# Altium project Rubiks_Controller.PrjPcb
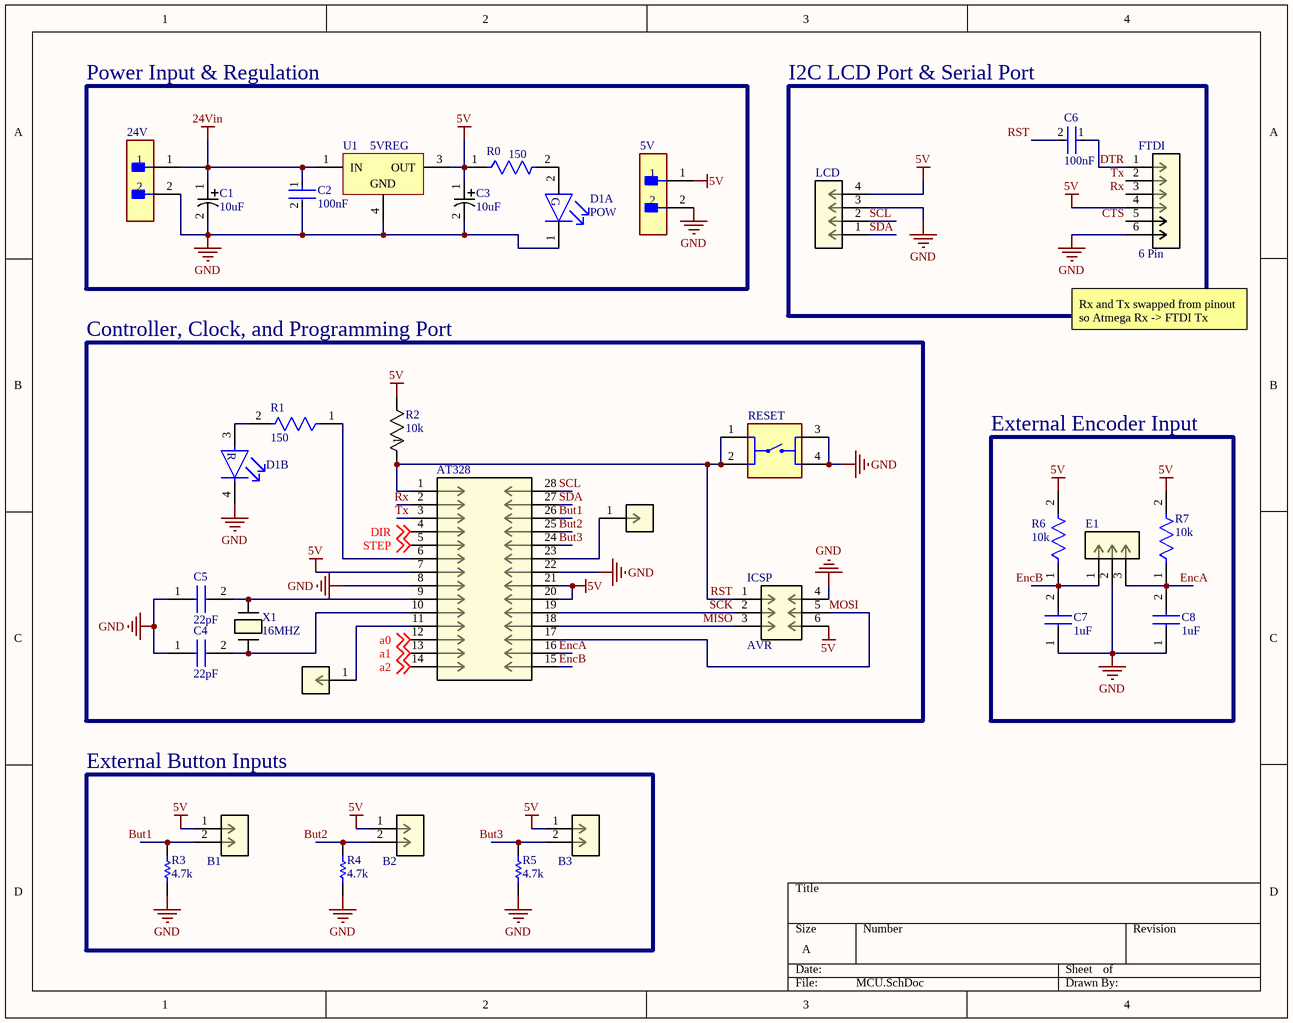
[diagram p0: MCU.SchDoc]
3 sheets, 62 parts. Net scope: global (net labels, ports and power ports of the same name join across sheets).
Board file: MainControl.PcbDoc
Sheets:
  MCU.SchDoc
  ComboLogic.SchDoc
  MotorDrive.SchDoc

## Sheet MCU.SchDoc
size A; SheetNumber: 1; SheetTotal: 3

### Parts
5V  (no value)  [FP-TSW-102-07-L-S-MFG]
24V  (no value)  [FP-TSW-102-07-L-S-MFG]
AT328  Atmega328  [CONN28_1-2199298-9_TEC]  (value not drawn)
B1  Header  [1x2StanHeader]  (value not drawn)
B2  Header  [1x2StanHeader]  (value not drawn)
B3  Header  [1x2StanHeader]  (value not drawn)
C1  10uF  [CAP_EEE_C_PAN-M]
C2  100nF  [FP-CL21-IPC_C]
C3  10uF  [CAP_EEE_C_PAN-M]
C4  22pF  [C0805]
C5  22pF  [C0805]
C6  100nF  [FP-CL21-IPC_C]
C7  1uF  [CAPC2012X135N]
C8  1uF  [CAPC2012X135N]
D1  POW  [FP-LTST-C235KGKRKT-MFG]  (parts A,B of 2)
E1  Encoder  [1x3StanHeader]  (value not drawn)
FTDI  6 Pin  [USB FTDI 1x6]
ICSP  AVR  [2x3StanHeader]
JB  Header  [1x1StanHeader]  (value not drawn)
JC  Header  [1x1StanHeader]  (value not drawn)
LCD  LCD  [1x4StanHeader]  (value not drawn)
R0  150  [FP-ERJ6GE-MFG]
R1  150  [FP-ERJ6GE-MFG]
R2  10k  [RES_AC0805_YAG-M]
R3  4.7k  [RESC2013X50X30LL20T20]
R4  4.7k  [RESC2013X50X30LL20T20]
R5  4.7k  [RESC2013X50X30LL20T20]
R6  10k  [FP-MC01W0805-IPC_C]
R7  10k  [FP-MC01W0805-IPC_C]
RESET  Reset  [SW_1825910-6-4]  (value not drawn)
U1  5VREG  [TO-263_M]
X1  16MHZ  [XTAL_ATS-49_CTS]

### Blocks framed on the sheet
Power Input & Regulation: 5V 24V C1-C3 D1 R0 U1
I2C LCD Port & Serial Port: C6 FTDI LCD
Controller, Clock, and Programming Port: AT328 C4 C5 D1 ICSP JB JC R1 R2 RESET X1
External Encoder Input: C7 C8 E1 R6 R7
External Button Inputs: B1-B3 R3-R5

### Nets
5V: 5V.1 AT328.7 AT328.20 AT328.21 B1.1 B2.1 B3.1 C3.1 FTDI.4 ICSP.6 LCD.4 R0.1 R2.2 R6.2 R7.2 U1.3(OUT)
24Vin: 24V.1 C1.1 C2.1 U1.1(IN)
GND: 5V.2 24V.2 AT328.8 AT328.22 C1.2 C2.2 C3.2 C4.1 C5.1 C7.1 C8.1 D1.1(Green_C) D1.4(Red_C) E1.2 FTDI.6 ICSP.4 LCD.3 R3.1 R4.1 R5.1 RESET.3 RESET.4 U1.4(GND)
a0: AT328.12 ; off-sheet a0
a1: AT328.13 ; off-sheet a1
a2: AT328.14 ; off-sheet a2
But1: AT328.26 B1.2 R3.2
But2: AT328.25 B2.2 R4.2
But3: AT328.24 B3.2 R5.2
CTS: FTDI.5
DIR: AT328.4 ; off-sheet DIR
DTR: C6.1 FTDI.1
EncA: AT328.16 C8.2 E1.3 R7.1
EncB: AT328.15 C7.2 E1.1 R6.1
MISO: AT328.18 ICSP.3
MOSI: AT328.17 ICSP.5
RST: AT328.1 C6.2 ICSP.1 R2.1 RESET.1 RESET.2
Rx: AT328.2 FTDI.3
SCK: AT328.19 ICSP.2
SCL: AT328.28 LCD.2
SDA: AT328.27 LCD.1
STEP: AT328.5 ; off-sheet STEP
Tx: AT328.3 FTDI.2
NetAT328_6: AT328.6 R1.1
NetAT328_9: AT328.9 C5.2 X1.2
NetAT328_10: AT328.10 C4.2 X1.1
NetAT328_11: AT328.11 JB.1
NetAT328_23: AT328.23 JC.1
NetD1_2: D1.2(Green_A) R0.2
NetD1_3: D1.3(Red_A) R1.2

### Notes on the sheet
- Rx and Tx swapped from pinout so Atmega Rx -> FTDI Tx
- (in symbol CMP-22017-000042-1, part A) G
- (in symbol CMP-22017-000042-1, part B) R

### Library data of the parts
5V 24V = CMP-02766-001428-1: CONN HEADER VERT 2POS 2.54MM   TSW-102-07-L-S; Voltage Rating: 550V; Current Rating: 7.6A; Gender: Male; Number of Contacts: 2; Connector Type: Male Pin; Radiation Hardening: No; Orientation: Straight; Contact Plating: Gold; Max Operating Temperature: 125°C; Mount: Through Hole; Package Quantity: 1; Number of Rows: 1; Housing Material: Polyester; RoHS Compliant: Yes; Length: 5.08mm; Max Voltage Rating (AC): 550V; Pitch: 2.54mm; Packaging: Bulk; Depth: 2.54mm; Termination: Solder; Min Operating Temperature: -55°C; Housing Color: Black; Lead Free: Lead Free; Color: Black; Number of Positions: 2; Width: 2.54mm; Max Current Rating: 7.6A; REACH SVHC: No SVHC; Contact Material: Bronze; Contact Mating Length: 0.23inch; Series: TSW; Contact Type: Male Pin
AT328 = 14x2_J: No Description Available   1-2199298-9; Mfr_Name: TE Connectivity; Type: DEV; Copyright: Copyright (C) 2022 Ultra Librarian. All rights reserved.; Manufacturer_Part_Number: 1-2199298-9; RefDes: RefDes
B1-B3 = 2x1_J: No Description Available; Manufacturer_Part_Number: 5-826631-0; Vendor: TE Connectivity; Built_By: EMA_UL_Team; SourceLibrary: Tyco_2012-04-26; Copyright: Copyright (C) 2018 Accelerated Designs. All rights reserved; RefDes: RefDes; Type: DEV
C1 C3 = EEE-1VA100SR: Mfr_Name: Panasonic; Type: DEV; Copyright: Copyright (C) 2022 Ultra Librarian. All rights reserved.; Manufacturer_Part_Number: EEE-1VA100SR; RefDes: RefDes
C2 C6 = CMP-2000-05017-2: CL21 Series 0805 100nF 50V ±10% Tolerance X7R Multilayer Ceramic Chip Capacitor CL21B104KBCNNNC; Depth: 1.25mm; Height: 0.85mm; Width: 0.049inch; Tolerance: 10%; Case Code (Metric): 2012; Case Code (Imperial): 0805; Material: Ceramic; Thickness: 0.037inch; Min Operating Temperature: -55°C; Contact Plating: Tin; Length: 2mm; Mount: Surface Mount; Voltage Rating (DC): 50V; Lead Free: Lead Free; Dielectric: X7R; Radiation Hardening: No; Capacitance: 100nF; Voltage Rating: 50V; Case/Package: 0805; Packaging: Tape and Reel; Max Operating Temperature: 125°C; Voltage: 50V
C4 C5 = C0805C220J4GACTU: Capacitor C0805C220J4GACTU; Manufacturer_Name: KEMET; Datasheet Link: https://componentsearchengine.com//C0805C220J4GACTU.pdf; Height: 1.1mm; Mouser2 Part Number: 80-C0805C220J4GACTU; Mouser2 Price/Stock: https://www.mouser.com/Search/Refine.aspx?Keyword=80-C0805C220J4GACTU; Manufacturer_Part_Number: C0805C220J4GACTU
C7 C8 = CL21B105KAFNNNE: Capacitor CL21B105KAFNNNE; Manufacturer_Name: Samsung Electro-Mechanics; Datasheet Link: https://media.digikey.com/pdf/Data%20Sheets/Samsung%20PDFs/CL_Series_MLCC_ds.pdf; Height: 1.35mm; Manufacturer_Part_Number: CL21B105KAFNNNE; Mouser Part Number: 187-CL21B105KAFNNNE; Mouser Price/Stock: https://www.mouser.co.uk/ProductDetail/Samsung-Electro-Mechanics/CL21B105KAFNNNE?qs=349EhDEZ59rlwSnoUrPIow%3D%3D; Arrow Part Number: CL21B105KAFNNNE; Arrow Price/Stock: https://www.arrow.com/en/products/cl21b105kafnnne/samsung-electro-mechanics
D1 = CMP-22017-000042-1: LED GREEN/RED CLEAR CHIP SMD LTST-C235KGKRKT; Luminous Intensity: 45mcd; Power Rating: 75mW; Forward Voltage: 2V; Illumination Color: Green; Number of LEDs: 2; Lens Color: Colorless; Test Current: 20mA; Dominant Wavelength: 631nm; Viewing Angle: 130°; Reverse Voltage: 5V; Mount: Surface Mount; Case/Package: SMD/SMT; Case Code (Metric): 3216; Case Code (Imperial): 1206; Height: 1.1mm; Color: Green; Package Quantity: 1; Radiation Hardening: No; Width: 1.6mm; Lens Transparency: Clear; Depth: 1.6mm; Lens Style: Clear; Forward Current: 20mA; Number of Pins: 4; Power Dissipation: 75mW; Min Operating Temperature: -30°C; Length: 3.2mm; Lead Free: Lead Free; Packaging: Tape and Reel; Max Operating Temperature: 85°C; Number of Elements: 2; RoHS Compliant: Yes
E1 = 3x1_J: No Description Available; Manufacturer_Part_Number: 5-826631-0; Vendor: TE Connectivity; Built_By: EMA_UL_Team; SourceLibrary: Tyco_2012-04-26; Copyright: Copyright (C) 2018 Accelerated Designs. All rights reserved; RefDes: RefDes; Type: DEV
FTDI = FTDI USB: No Description Available; Manufacturer_Part_Number: 5-826631-0; Vendor: TE Connectivity; Built_By: EMA_UL_Team; SourceLibrary: Tyco_2012-04-26; Copyright: Copyright (C) 2018 Accelerated Designs. All rights reserved; RefDes: RefDes; Type: DEV
ICSP = 2x3_J: No Description Available; Manufacturer_Part_Number: 5-826631-0; Vendor: TE Connectivity; Built_By: EMA_UL_Team; SourceLibrary: Tyco_2012-04-26; Copyright: Copyright (C) 2018 Accelerated Designs. All rights reserved; RefDes: RefDes; Type: DEV
JB JC = 1x1_J: No Description Available; Manufacturer_Part_Number: 5-826631-0; Vendor: TE Connectivity; Built_By: EMA_UL_Team; SourceLibrary: Tyco_2012-04-26; Copyright: Copyright (C) 2018 Accelerated Designs. All rights reserved; RefDes: RefDes; Type: DEV
LCD = 4x1_J: No Description Available; Manufacturer_Part_Number: 5-826631-0; Vendor: TE Connectivity; Built_By: EMA_UL_Team; SourceLibrary: Tyco_2012-04-26; Copyright: Copyright (C) 2018 Accelerated Designs. All rights reserved; RefDes: RefDes; Type: DEV
R0 R1 = CMP-1013-00054-3: RES SMD 150 OHM 5% 1/8W 0805 ERJ-6GEYJ151V; Manufacturer: Panasonic; Temperature Coefficient: 200ppm/°C; Voltage Rating: 150V; Value: 150Ω; Power Rating: 0.125W; Automotive Grade: Grade 0; RoHS: TRUE; Series: ERJ; Tolerance: 5%; Height: 0.7mm; Device Class L1: Passive Components; Temperature Range Low: -55°C; Device Class L3: Chip SMD Resistors; Lead Free: Yes; Manufacturer Part Number: ERJ-6GEYJ151V; Composition: Thick Film; Temperature: -55°C to +155°C; Mouser Description: Thick Film Resistors - SMD 0805 150ohms 5% Tol; Footprint Url: https://industrial.panasonic.com/cdbs/www-data/pdf/RDA0000/DMA0000COL17.pdf; Device Class L2: Resistors; Category: Res; Ipc Land Pattern Name: RESC200125X60; Temperature Range High: +155°C; ComponentLink2URL: https://industrial.panasonic.com/ww/products/resistors/chip-resistors/general-purpose-chip-resistors/thick-film-chip-resistors/ERJ6GEYJ151V; Package: ERJ6GE; Digikey Description: RES SMD 150 OHM 5% 1/8W 0805; Resistance: 150Ω; ComponentLink2Description: Datasheet; Octopart: https://octopart.com/erj-6geyj151v-panasonic-55422917; Automotive: Yes
R2 = AC0805FR-070RL: Mfr_Name: Yageo; Copyright: Copyright (C) 2022 Ultra Librarian. All rights reserved.; Manufacturer_Part_Number: AC0805FR-070RL; RefDes: RefDes; Type: DEV
R3-R5 = CMP-2001-03968-1: CRCW08054K70JNEB; Manufacturer: Vishay Dale; Part Number: CRCW08054K70JNEB
R6 R7 = CMP-12256-000003-1: Resistor, 10K, 0.1W, 1%, 0805, Reel MC01W0805110K; Resistance: 10kR; Voltage Rating: 150V; Temperature Coefficient: 100ppm/°C; Power Rating: 100mW; REACH SVHC: No SVHC; Composition: Thick Film; Max Operating Temperature: 155°C; Case/Package: 0805; Tolerance: 1%; Number of Pins: 2; Case Code (Metric): 2012; Voltage Rating (DC): 150V; Min Operating Temperature: -55°C; Width: 1.25mm; Case Code (Imperial): 0805; Packaging: Cut Tape
RESET = CMP-009-000000-1: Switch Tactile OFF (ON) SPST Round Button PC Pins 0.05A 24VDC 100000Cycles 1.57N Thru-Hole Loose; Value: *; Package: None; Pin Count: 4; Price: None; Component Type: Standard; Design Item ID: 1825910-6; Source: 1825910-6.SchLib; Availability: Unavailable; MP: 1825910-6
U1 = CMP-0244-00213-1: Positive Voltage Regulator, 3-Pin D2PAK, Tape and Reel L7805CD2T-TR; PackageReference: TO-263; ComponentLink2URL: http://www.st.com/internet/com/TECHNICAL_RESOURCES/TECHNICAL_LITERATURE/DATASHEET/CD00000444.pdf; PackageDescription: 3-Pin Transistor Outline Package 2.54 mm Pitch, 15.4 mm Lead Span (D2PAK); DatasheetVersion: 16/11/2011; ComponentLink2Description: Datasheet; ComponentLink1Description: Manufacturer URL; PackageVersion: 2011; ComponentLink1URL: http://www.st.com
X1 = ATS-49/U-16.0000MHZ: Mfr_Name: CTS Components; Copyright: Copyright (C) 2022 Ultra Librarian. All rights reserved.; Manufacturer_Part_Number: ATS-49/U-16.0000MHZ; RefDes: RefDes; Type: DEV

## Sheet ComboLogic.SchDoc
size A; SheetNumber: 2; SheetTotal: 3
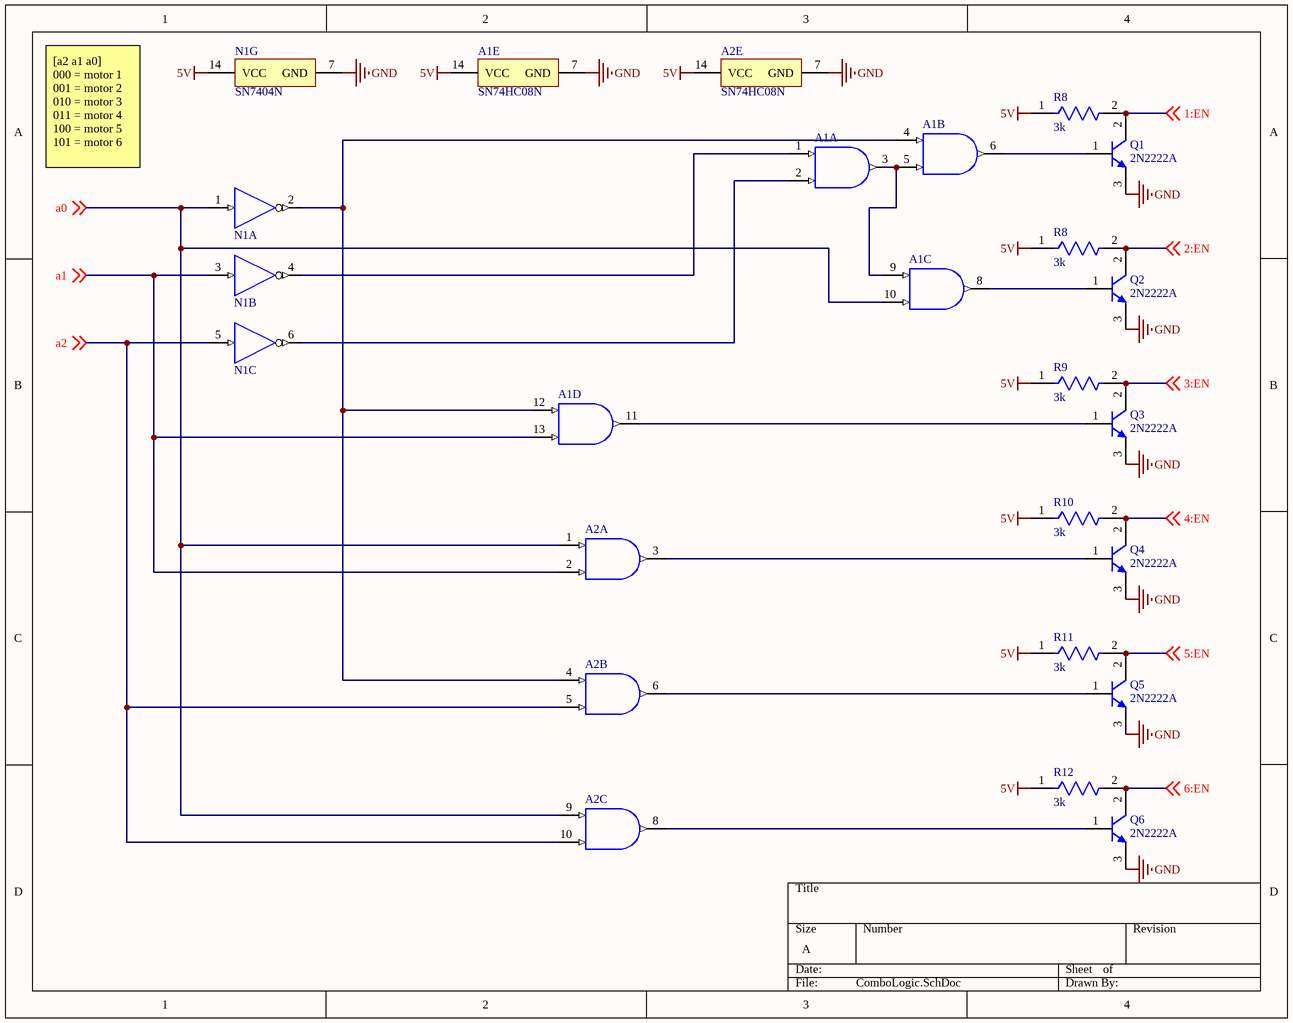
[diagram p1: ComboLogic.SchDoc]

### Parts
(Parts that share a designator on the sheet are numbered #1, #2 ... from top to bottom, then left to right.)
A1#1  SN74HC08N  [N0014A]  (value not drawn)  (parts A,B,C,D,E of 5)
A2#1  SN74HC08N  [N0014A]  (value not drawn)  (parts A,B,C,E of 5)
N1  SN7404N  [N0014A]  (value not drawn)  (parts A,B,C,G of 7)
Q1  2N2222A  [STM-TO-18-3]
Q2  2N2222A  [STM-TO-18-3]
Q3  2N2222A  [STM-TO-18-3]
Q4  2N2222A  [STM-TO-18-3]
Q5  2N2222A  [STM-TO-18-3]
Q6  2N2222A  [STM-TO-18-3]
R8#1  3k  [FP-RR1220-IPC_B]
R8#2  3k  [FP-RR1220-IPC_B]
R9  3k  [FP-RR1220-IPC_B]
R10  3k  [FP-RR1220-IPC_B]
R11  3k  [FP-RR1220-IPC_B]
R12  3k  [FP-RR1220-IPC_B]

### Nets
5V: A1#1.14(VCC) A2#1.14(VCC) N1.14(VCC) R8#1.1 R8#2.1 R9.1 R10.1 R11.1 R12.1
GND: A1#1.7(GND) A2#1.7(GND) N1.7(GND) Q1.3(E) Q2.3(E) Q3.3(E) Q4.3(E) Q5.3(E) Q6.3(E)
1:EN: Q1.2(C) R8#1.2 ; off-sheet 1:EN
2:EN: Q2.2(C) R8#2.2 ; off-sheet 2:EN
3:EN: Q3.2(C) R9.2 ; off-sheet 3:EN
4:EN: Q4.2(C) R10.2 ; off-sheet 4:EN
5:EN: Q5.2(C) R11.2 ; off-sheet 5:EN
6:EN: Q6.2(C) R12.2 ; off-sheet 6:EN
a0: A1#1.10(3B) A2#1.1(1A) A2#1.9(3A) N1.1(1A) ; off-sheet a0
a1: A1#1.13(4B) A2#1.2(1B) N1.3(2A) ; off-sheet a1
a2: A2#1.5(2B) A2#1.10(3B) N1.5(3A) ; off-sheet a2
NetA1#1_1: A1#1.1(1A) N1.4(~{2Y})
NetA1#1_2: A1#1.2(1B) N1.6(~{3Y})
NetA1#1_3: A1#1.3(1Y) A1#1.5(2B) A1#1.9(3A)
NetA1#1_4: A1#1.4(2A) A1#1.12(4A) A2#1.4(2A) N1.2(~{1Y})
NetA1#1_6: A1#1.6(2Y) Q1.1(B)
NetA1#1_8: A1#1.8(3Y) Q2.1(B)
NetA1#1_11: A1#1.11(4Y) Q3.1(B)
NetA2#1_3: A2#1.3(1Y) Q4.1(B)
NetA2#1_6: A2#1.6(2Y) Q5.1(B)
NetA2#1_8: A2#1.8(3Y) Q6.1(B)

### Notes on the sheet
- [a2 a1 a0]
  000 = motor 1
  001 = motor 2
  010 = motor 3
  011 = motor 4
  100 = motor 5
  101 = motor 6

### Library data of the parts
A1#1 A2#1 = CMP-0777-00250-3: Quadruple 2-Input Positive-AND Gates, N0014A, TUBE; Manufacturer: Texas Instruments; Output Type: CMOS; ICC @ Nom Voltage(Max)(mA): 0.02; tpd @ Nom Voltage(Max)(ns): 28; Voltage(Nom)(V): 5; VCC(Min)(V): 2; Technology Family: HC; F @ Nom Voltage(Max)(Mhz): 70; Rating: Catalog; Bits(#): 4; Schmitt Trigger: No; VCC(Max)(V): 6; PackageReference: N0014A; Input Type: CMOS; Generic Part Number: SN74HC08; DatasheetVersion: SCLS081F; Operating Temperature Range(C): -40 to 85
N1 = CMP-1615-00872-2: Hex inverters, N0014A, TUBE; Generic Part Number: SN7404; Manufacturer: Texas Instruments; Voltage(Nom)(V): 5; Bits(#): 6; tpd @ Nom Voltage(Max)(ns): 22; Schmitt Trigger: No; VCC(Max)(V): 5.25; ICC @ Nom Voltage(Max)(mA): 0.033; Technology Family: TTL; Rating: Catalog; F @ Nom Voltage(Max)(Mhz): 35; Output Type: CMOS; VCC(Min)(V): 4.75; Output Drive (IOL/IOH)(Max)(mA): -0.4/16; DatasheetVersion: SDLS029C; Code_JEDEC: MS-001; Operating Temperature Range(C): 0 to 70; PackageReference: N0014A; Input Type: TTL
Q1-Q6 = CMP-2000-05381-1: High Speed Switch, 0.6 A IC, -65 to 175 degC, 3-Pin TO-18, RoHS, Bulk; Manufacturer: STMicroelectronics; Power Dissipation Pd: 500mW; DC Current Gain hFE: 300hFE; Transistor Polarity: NPN; DC Collector Current: 600mA; No. of Pins: 3Pins; Transition Frequency ft: 300MHz; Collector Emitter Voltage V(br)ceo: 40V; Product Range: -; Package Reference: TO-18-3; Datasheet URL: https://datasheet.ciiva.com/25917/cd00003223-25917094.pdf; Automotive Qualification Standard: -; Transistor Case Style: TO-18; Operating Temperature Max: 175degC; Datasheet Version: Feb-03; Package Description: 3-Pin Through Hole Device, Dia 5.8 mm, Pitch 1.27 mm; Manufacturer URL: http://www.st.com/
R8#1 R8#2 R9-R12 = CMP-2001-03369-2: 3kΩ ±0.5% 0.1W 1/10W Chip Resistor 0805 (2012 Metric) Thin Film; Temperature Coefficient: 25ppm/°C; Voltage Rating: 100V; Max Power Dissipation: 100mW; Resistance: 3kR; Min Operating Temperature: -55°C; Resistor Type: Thin Film; Mount: Surface Mount; Case Code (Imperial): 0805; Technology: THIN FILM; Length: 2mm; Voltage Rating (DC): 100V; Case/Package: 0805; Depth: 1.25mm; Lead Free: Lead Free; Packaging: Tape and Reel; Series: RR; Termination: SMD/SMT; Tolerance: 0.5%; Package Quantity: 1; Max Operating Temperature: 125°C; RoHS Compliant: Yes; Width: 0.049inch; Height: 0.4mm; Number of Terminations: 2; Case Code (Metric): 2012; Size Code: 0805; Number of Pins: 2; Power Rating: 100mW

## Sheet MotorDrive.SchDoc
size A; SheetNumber: 3; SheetTotal: 3
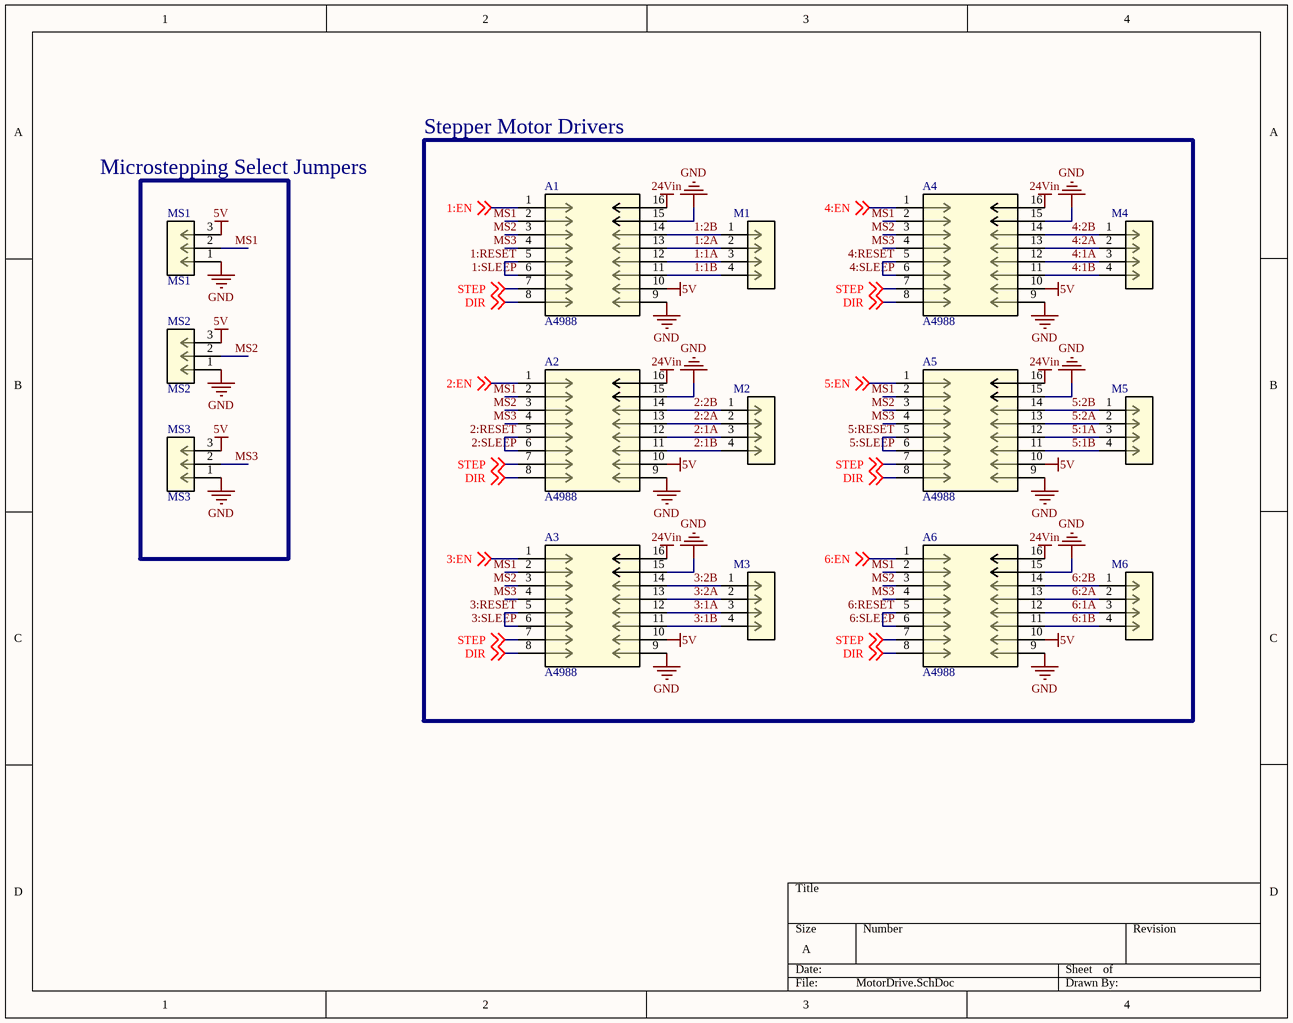
[diagram p2: MotorDrive.SchDoc]

### Parts
(Parts that share a designator on the sheet are numbered #1, #2 ... from top to bottom, then left to right.)
A1#2  A4988  [2x8A4988]
A2#2  A4988  [2x8A4988]
A3  A4988  [2x8A4988]
A4  A4988  [2x8A4988]
A5  A4988  [2x8A4988]
A6  A4988  [2x8A4988]
M1  (no value)  [1x4StanHeader]
M2  (no value)  [1x4StanHeader]
M3  (no value)  [1x4StanHeader]
M4  (no value)  [1x4StanHeader]
M5  (no value)  [1x4StanHeader]
M6  (no value)  [1x4StanHeader]
MS1  MS1  [1x3StanHeader]
MS2  MS2  [1x3StanHeader]
MS3  MS3  [1x3StanHeader]

### Blocks framed on the sheet
Stepper Motor Drivers: A1#2 A2#2 A3-A6 M1-M6

### Nets
5V: A1#2.10 A2#2.10 A3.10 A4.10 A5.10 A6.10 MS1.3 MS2.3 MS3.3
24Vin: A1#2.16 A2#2.16 A3.16 A4.16 A5.16 A6.16
GND: A1#2.9 A1#2.15 A2#2.9 A2#2.15 A3.9 A3.15 A4.9 A4.15 A5.9 A5.15 A6.9 A6.15 MS1.1 MS2.1 MS3.1
1:1A: A1#2.12 M1.3
1:1B: A1#2.11 M1.4
1:2A: A1#2.13 M1.2
1:2B: A1#2.14 M1.1
1:EN: A1#2.1 ; off-sheet 1:EN
1:RESET: A1#2.5 A1#2.6  [also labelled 1:SLEEP]
2:1A: A2#2.12 M2.3
2:1B: A2#2.11 M2.4
2:2A: A2#2.13 M2.2
2:2B: A2#2.14 M2.1
2:EN: A2#2.1 ; off-sheet 2:EN
2:RESET: A2#2.5 A2#2.6  [also labelled 2:SLEEP]
3:1A: A3.12 M3.3
3:1B: A3.11 M3.4
3:2A: A3.13 M3.2
3:2B: A3.14 M3.1
3:EN: A3.1 ; off-sheet 3:EN
3:RESET: A3.5 A3.6  [also labelled 3:SLEEP]
4:1A: A4.12 M4.3
4:1B: A4.11 M4.4
4:2A: A4.13 M4.2
4:2B: A4.14 M4.1
4:EN: A4.1 ; off-sheet 4:EN
4:RESET: A4.5 A4.6  [also labelled 4:SLEEP]
5:1A: A5.12 M5.3
5:1B: A5.11 M5.4
5:2A: A5.13 M5.2
5:2B: A5.14 M5.1
5:EN: A5.1 ; off-sheet 5:EN
5:RESET: A5.5 A5.6  [also labelled 5:SLEEP]
6:1A: A6.12 M6.3
6:1B: A6.11 M6.4
6:2A: A6.13 M6.2
6:2B: A6.14 M6.1
6:EN: A6.1 ; off-sheet 6:EN
6:RESET: A6.5 A6.6  [also labelled 6:SLEEP]
DIR: A1#2.8 A2#2.8 A3.8 A4.8 A5.8 A6.8 ; off-sheet DIR
MS1: A1#2.2 A2#2.2 A3.2 A4.2 A5.2 A6.2 MS1.2
MS2: A1#2.3 A2#2.3 A3.3 A4.3 A5.3 A6.3 MS2.2
MS3: A1#2.4 A2#2.4 A3.4 A4.4 A5.4 A6.4 MS3.2
STEP: A1#2.7 A2#2.7 A3.7 A4.7 A5.7 A6.7 ; off-sheet STEP

### Notes on the sheet
- Microstepping Select Jumpers

### Library data of the parts
A1#2 A2#2 A3-A6 = 8x2_A4988: No Description Available; Mfr_Name: TE Connectivity; Manufacturer_Part_Number: 1-2199298-9; Type: DEV; Copyright: Copyright (C) 2022 Ultra Librarian. All rights reserved.; RefDes: RefDes
M1-M6 = 4x1_J: as LCD on sheet MCU; Copyright: Copyright (C) 2018 Accelerated Designs. All rights reserved; RefDes: RefDes; Type: DEV
MS1-MS3 = 3x1_J: as E1 on sheet MCU; Copyright: Copyright (C) 2018 Accelerated Designs. All rights reserved; RefDes: RefDes; Type: DEV

## Nets that join several sheets
5V: MCU (16 pins), ComboLogic (9 pins), MotorDrive (9 pins)
24Vin: MCU (24V.1 C1.1 C2.1 U1.1), MotorDrive (6 pins)
GND: MCU (23 pins), ComboLogic (9 pins), MotorDrive (15 pins)
1:EN: ComboLogic (Q1.2 R8#1.2), MotorDrive (A1#2.1)
2:EN: ComboLogic (Q2.2 R8#2.2), MotorDrive (A2#2.1)
3:EN: ComboLogic (Q3.2 R9.2), MotorDrive (A3.1)
4:EN: ComboLogic (Q4.2 R10.2), MotorDrive (A4.1)
5:EN: ComboLogic (Q5.2 R11.2), MotorDrive (A5.1)
6:EN: ComboLogic (Q6.2 R12.2), MotorDrive (A6.1)
a0: MCU (AT328.12), ComboLogic (A1#1.10 A2#1.1 A2#1.9 N1.1)
a1: MCU (AT328.13), ComboLogic (A1#1.13 A2#1.2 N1.3)
a2: MCU (AT328.14), ComboLogic (A2#1.5 A2#1.10 N1.5)
DIR: MCU (AT328.4), MotorDrive (6 pins)
STEP: MCU (AT328.5), MotorDrive (6 pins)